# Altium schematic sheet ESP32_MOTORS.SchDoc
size A; SheetNumber: 5; SheetTotal: 5
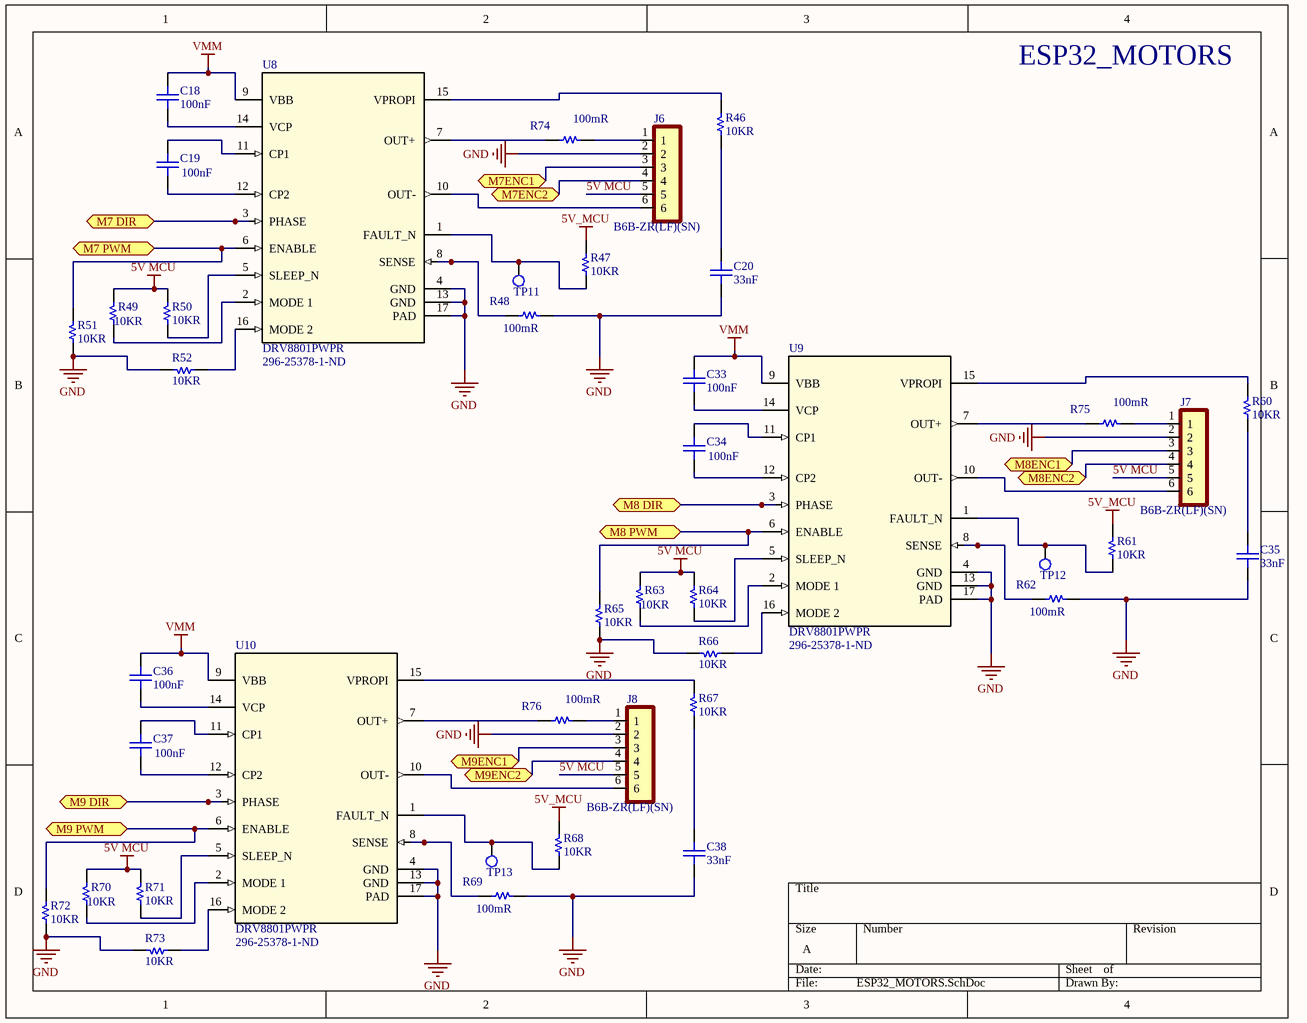
[diagram p0: ESP32_MOTORS.SchDoc]

## Parts
C18  100nF  [CAP_ADJ_0805]
C19  100nF  [CAP_ADJ_0805]
C20  33nF  [CAP_ADJ_0805]
C33  100nF  [CAP_ADJ_0805]
C34  100nF  [CAP_ADJ_0805]
C35  33nF  [CAP_ADJ_0805]
C36  100nF  [CAP_ADJ_0805]
C37  100nF  [CAP_ADJ_0805]
C38  33nF  [CAP_ADJ_0805]
J6  B6B-ZR(LF)(SN)  [JST_B6B-ZR(LF)(SN)]
J7  B6B-ZR(LF)(SN)  [JST_B6B-ZR(LF)(SN)]
J8  B6B-ZR(LF)(SN)  [JST_B6B-ZR(LF)(SN)]
R46  10KR  [RES_ADJ_0805_YAGEO]
R47  10KR  [RES_ADJ_0805_YAGEO]
R48  100mR  [RES_ADJ_0805_YAGEO]
R49  10KR  [RES_ADJ_0805_YAGEO]
R50  10KR  [RES_ADJ_0805_YAGEO]
R51  10KR  [RES_ADJ_0805_YAGEO]
R52  10KR  [RES_ADJ_0805_YAGEO]
R60  10KR  [RES_ADJ_0805_YAGEO]
R61  10KR  [RES_ADJ_0805_YAGEO]
R62  100mR  [RES_ADJ_0805_YAGEO]
R63  10KR  [RES_ADJ_0805_YAGEO]
R64  10KR  [RES_ADJ_0805_YAGEO]
R65  10KR  [RES_ADJ_0805_YAGEO]
R66  10KR  [RES_ADJ_0805_YAGEO]
R67  10KR  [RES_ADJ_0805_YAGEO]
R68  10KR  [RES_ADJ_0805_YAGEO]
R69  100mR  [RES_ADJ_0805_YAGEO]
R70  10KR  [RES_ADJ_0805_YAGEO]
R71  10KR  [RES_ADJ_0805_YAGEO]
R72  10KR  [RES_ADJ_0805_YAGEO]
R73  10KR  [RES_ADJ_0805_YAGEO]
R74  100mR  [RES_ADJ_0805_YAGEO]
R75  100mR  [RES_ADJ_0805_YAGEO]
R76  100mR  [RES_ADJ_0805_YAGEO]
TP11  TEST_POINT  [TEST_POINT]  (value not drawn)
TP12  TEST_POINT  [TEST_POINT]  (value not drawn)
TP13  TEST_POINT  [TEST_POINT]  (value not drawn)
U8  DRV8801PWPR  Supplier Part Number 1: 296-25378-1-ND  [PWP0016B_N]
U9  DRV8801PWPR  Supplier Part Number 1: 296-25378-1-ND  [PWP0016B_N]
U10  DRV8801PWPR  Supplier Part Number 1: 296-25378-1-ND  [PWP0016B_N]

## Ports
M7 DIR (bidir), M7 PWM (bidir), M7ENC1 (bidir), M7ENC2 (bidir), M8 DIR (bidir), M8 PWM (bidir), M8ENC1 (bidir), M8ENC2 (bidir), M9 DIR (bidir), M9 PWM (bidir), M9ENC1 (bidir), M9ENC2 (bidir)

## Nets
5V MCU: J6.5 J7.5 J8.5 R49.2 R50.2 R63.2 R64.2 R70.2 R71.2
5V_MCU: R47.2 R61.2 R68.2
GND: C20.1 C35.1 C38.1 J6.2 J7.2 J8.2 R48.2 R51.1 R52.2 R62.2 R65.1 R66.2 R69.2 R72.1 R73.2 U8.4(GND) U8.13(GND) U8.17(PAD) U9.4(GND) U9.13(GND) U9.17(PAD) U10.4(GND) U10.13(GND) U10.17(PAD)
VMM: C18.2 C33.2 C36.2 U8.9(VBB) U9.9(VBB) U10.9(VBB)
M7 DIR: U8.3(PHASE) ; port M7 DIR
M7 PWM: R51.2 U8.6(ENABLE) ; port M7 PWM
M7ENC1: J6.3 ; port M7ENC1
M7ENC2: J6.4 ; port M7ENC2
M8 DIR: U9.3(PHASE) ; port M8 DIR
M8 PWM: R65.2 U9.6(ENABLE) ; port M8 PWM
M8ENC1: J7.3 ; port M8ENC1
M8ENC2: J7.4 ; port M8ENC2
M9 DIR: U10.3(PHASE) ; port M9 DIR
M9 PWM: R72.2 U10.6(ENABLE) ; port M9 PWM
M9ENC1: J8.3 ; port M9ENC1
M9ENC2: J8.4 ; port M9ENC2
NetC18_1: C18.1 U8.14(VCP)
NetC19_1: C19.1 U8.12(CP2)
NetC19_2: C19.2 U8.11(CP1)
NetC20_2: C20.2 R46.1
NetC33_1: C33.1 U9.14(VCP)
NetC34_1: C34.1 U9.12(CP2)
NetC34_2: C34.2 U9.11(CP1)
NetC35_2: C35.2 R60.1
NetC36_1: C36.1 U10.14(VCP)
NetC37_1: C37.1 U10.12(CP2)
NetC37_2: C37.2 U10.11(CP1)
NetC38_2: C38.2 R67.1
NetJ6_1: J6.1 R74.2
NetJ6_6: J6.6 U8.10(OUT-)
NetJ7_1: J7.1 R75.2
NetJ7_6: J7.6 U9.10(OUT-)
NetJ8_1: J8.1 R76.2
NetJ8_6: J8.6 U10.10(OUT-)
NetR46_2: R46.2 U8.15(VPROPI)
NetR47_1: R47.1 TP11.1 U8.1(FAULT_N)
NetR48_1: R48.1 U8.8(SENSE)
NetR49_1: R49.1 U8.2(MODE_1)
NetR50_1: R50.1 U8.5(SLEEP_N)
NetR52_1: R52.1 U8.16(MODE_2)
NetR60_2: R60.2 U9.15(VPROPI)
NetR61_1: R61.1 TP12.1 U9.1(FAULT_N)
NetR62_1: R62.1 U9.8(SENSE)
NetR63_1: R63.1 U9.2(MODE_1)
NetR64_1: R64.1 U9.5(SLEEP_N)
NetR66_1: R66.1 U9.16(MODE_2)
NetR67_2: R67.2 U10.15(VPROPI)
NetR68_1: R68.1 TP13.1 U10.1(FAULT_N)
NetR69_1: R69.1 U10.8(SENSE)
NetR70_1: R70.1 U10.2(MODE_1)
NetR71_1: R71.1 U10.5(SLEEP_N)
NetR73_1: R73.1 U10.16(MODE_2)
NetR74_1: R74.1 U8.7(OUT+)
NetR75_1: R75.1 U9.7(OUT+)
NetR76_1: R76.1 U10.7(OUT+)

## Notes on the sheet
- ESP32_MOTORS

## Library data of the parts
C18 C19 C33 C34 C36 C37 = CAP_ADJ_0805: CERAMIC CAPACITOR SMD 0805; Manufacturer: KEMET; Manufacturer Part Number: C0805C104J5RACAUTO; Voltage Rating: 50V; Tolerance: 5%; Dielectric: X7R; Supplier 1: Digi-Key; Supplier Part Number 1: 399-6925-1-ND; Stock 1: 9661; Pricing 1: 1=0.22, 10=0.152, 100=0.0769, 500=0.0526, 1000=0.0466 (USD); Mount: Surface Mount; Case/Package: 0805; Case Code (Metric): 2012; Case Code (Imperial): 0805; Dielectric Material: Ceramic; Min Operating Temperature: -55°C; Max Operating Temperature: 125°C; Package Quantity: 1; Capacitance: 100nF; Packaging: Cut Tape; Voltage Rating (DC): 50V; Length: 0.079inch; Width: 0.049inch; Thickness: 0.035inch; Depth: 1.25mm; REACH SVHC: No SVHC; ComponentLink1URL: http://components.arrow.com/part/dataview/0323_00324161; ComponentLink1Description: http://components.arrow.com/part/dataview/0323_00324161; ComponentLink2URL: http://www.farnell.com/datasheets/2123421.pdf; ComponentLink2Description: http://www.farnell.com/datasheets/2123421.pdf; ComponentLink3URL: https://search.kemet.com/component-edge/download/datasheet/C0805C104J5RACAUTO.pdf; ComponentLink3Description: https://search.kemet.com/component-edge/download/datasheet/C0805C104J5RACAUTO.pdf
C20 C35 C38 = CAP_ADJ_0805: CERAMIC CAPACITOR SMD 0805; Manufacturer: Samsung; Manufacturer Part Number: CL21B333JBANNNC; Tolerance: 5%; Voltage Rating: 50V; Dielectric: X7R; Supplier 1: Digi-Key; Supplier Part Number 1: 1276-2505-1-ND; Stock 1: 12525; Pricing 1: 1=0.21, 10=0.151, 100=0.0711, 500=0.0499, 1000=0.0413 (USD); Mount: Surface Mount; Case/Package: 0805; Case Code (Metric): 2012; Case Code (Imperial): 0805; Min Operating Temperature: -55°C; Max Operating Temperature: 125°C; Capacitance: 33nF; Packaging: Tape and Reel; Package Quantity: 1; Voltage: 50V; Voltage Rating (DC): 50V; Length: 2mm; Height: 0.65mm; Width: 0.049inch; Thickness: 0.03inch; Depth: 1.25mm; Radiation Hardening: No; ComponentLink1URL: https://datasheet.ciiva.com/26838/getdatasheetpartid-356482-26838724.pdf; ComponentLink1Description: https://datasheet.ciiva.com/26838/getdatasheetpartid-356482-26838724.pdf; ComponentLink2URL: https://datasheet.ciiva.com/25728/cl21b333jbannnc-25728473.pdf; ComponentLink2Description: https://datasheet.ciiva.com/25728/cl21b333jbannnc-25728473.pdf
J6-J8 = B6B-ZR(LF)(SN): Connector Header Through Hole 6 position 0.059 _1.50mm_; MF: JST Sales; MP: B6B-ZR_LF__SN_; Package: None; Price: None; SnapEDA_Link: https://www.snapeda.com/parts/B6B-ZR%28LF%29%28SN%29/JST%20Sales%20America%20Inc./view-part/279441/?ref=snap; Availability: Unavailable; Value: *
R46 R47 R49-R52 R60 R61 R63-R68 R70-R73 = RES_ADJ_0805: RESISTOR 0805 YAGEO; Manufacturer Part Number: RC0805JR-0710KL; Tolerance: 5%; Temperature Coefficient: 100ppm/°C; Power Rating: 125mW; Voltage Rating: 150V; Value: *; Supplier 1: Digi-Key; Supplier Part Number 1: 311-10KARDKR-ND; Manufacturer: Yageo; Stock 1: 1589050; Pricing 1: 1=0.1, 10=0.019, 100=0.0076, 1000=0.0034, 2500=0.003 (USD); Case/Package: 0805; Contact Plating: Tin,Matte; Case Code (Imperial): 0805; Case Code (Metric): 2012; Min Operating Temperature: -55°C; Max Operating Temperature: 155°C; Resistance: 10KR; Packaging: Tape and Reel; Composition: Thick Film; Termination: SMD/SMT; Military Standard: Not; Length: 2mm; Height: 0.5mm; Width: 1.25mm; Depth: 1.25mm; Radiation Hardening: No; REACH SVHC: Unknown; Lead Free: Lead Free; ComponentLink1URL: https://datasheet.ciiva.com/7983/444164-7983765.pdf; ComponentLink1Description: https://datasheet.ciiva.com/7983/444164-7983765.pdf; ComponentLink2URL: https://datasheet.ciiva.com/7941/444164-7941870.pdf; ComponentLink2Description: https://datasheet.ciiva.com/7941/444164-7941870.pdf; ComponentLink3URL: https://datasheet.ciiva.com/7941/444164-7941871.pdf; ComponentLink3Description: https://datasheet.ciiva.com/7941/444164-7941871.pdf
R48 R62 R69 R74-R76 = RES_ADJ_0805: RESISTOR 0805 YAGEO; Manufacturer: Panasonic; Manufacturer Part Number: ERJ-6DSFR10V; Tolerance: 1%; Max Power Dissipation: 500mW; Temperature Coefficient: 150ppm/°C; Supplier 1: Digi-Key; Supplier Part Number 1: P19308CT-ND; Stock 1: 16904; Pricing 1: 1=0.5, 10=0.36, 25=0.266, 50=0.196, 100=0.1438, 250=0.1188, 500=0.098, 1000=0.0709 (USD); Case/Package: 0805; Case Code (Metric): 2012; Case Code (Imperial): 0805; Min Operating Temperature: -55°C; Max Operating Temperature: 155°C; Packaging: Cut Tape; Resistance: 100mR; Composition: Thick Film; Number of Terminations: 2; Length: 0.079inch; Height: 0.028inch; Width: 0.049inch; ComponentLink1URL: https://industrial.panasonic.com/cdbs/www-data/pdf/RDN0000/AOA0000C313.pdf; ComponentLink1Description: https://industrial.panasonic.com/cdbs/www-data/pdf/RDN0000/AOA0000C313.pdf
TP11-TP13 = TEST_POINT: TEST POINT PAD
U8-U10 = DRV8801PWPR: IC MOTOR DRIVER PAR 16HTSSOP; Manufacturer: Texas Instruments; Max Supply Voltage: 38V; Min Supply Voltage: 8V; Output Current: 2.8A; Nominal Supply Current: 6mA; Logic Function: AND; Quiescent Current: 3.2mA; Operating Supply Voltage: 36V; Number of Outputs: 1; Interface: Parallel; Supplier 1: Digi-Key; Manufacturer Part Number: DRV8801PWPR; Stock 1: 45192; Pricing 1: 1=2.65, 10=2.377, 100=1.9109, 500=1.57, 1000=1.3008 (USD); Mount: Surface Mount; Case/Package: HTSSOP EP; Number of Pins: 16; Weight: 0.002212oz; Min Operating Temperature: -40°C; Max Operating Temperature: 85°C; Packaging: Tape and Reel; Package Quantity: 2000; Radiation Hardening: No; Lead Free: Lead Free; REACH SVHC: No SVHC; ComponentLink1URL: https://datasheet.ciiva.com/1958/drv8801-1958736.pdf; ComponentLink1Description: https://datasheet.ciiva.com/1958/drv8801-1958736.pdf; ComponentLink2URL: https://datasheet.ciiva.com/1958/drv8801-1958737.pdf; ComponentLink2Description: https://datasheet.ciiva.com/1958/drv8801-1958737.pdf; ComponentLink3URL: https://datasheet.ciiva.com/15109/getdatasheetpartid-362071-15109493.pdf; ComponentLink3Description: https://datasheet.ciiva.com/15109/getdatasheetpartid-362071-15109493.pdf; ComponentLink4URL: https://datasheet.ciiva.com/26086/drv8801-26086021.pdf; ComponentLink4Description: https://datasheet.ciiva.com/26086/drv8801-26086021.pdf; ComponentLink5URL: https://datasheet.ciiva.com/3229/drv8801-3229006.pdf; ComponentLink5Description: https://datasheet.ciiva.com/3229/drv8801-3229006.pdf; ComponentLink6URL: https://datasheet.ciiva.com/1958/drv8801-1958735.pdf; ComponentLink6Description: https://datasheet.ciiva.com/1958/drv8801-1958735.pdf; ComponentLink7URL: https://datasheet.ciiva.com/41457/001013558-da-01-en-ic-motor-driver-drv8801pwpr-tssop-16-tid-41457316.pdf; ComponentLink7Description: https://datasheet.ciiva.com/41457/001013558-da-01-en-ic-motor-driver-drv8801pwpr-tssop-16-tid-41457316.pdf